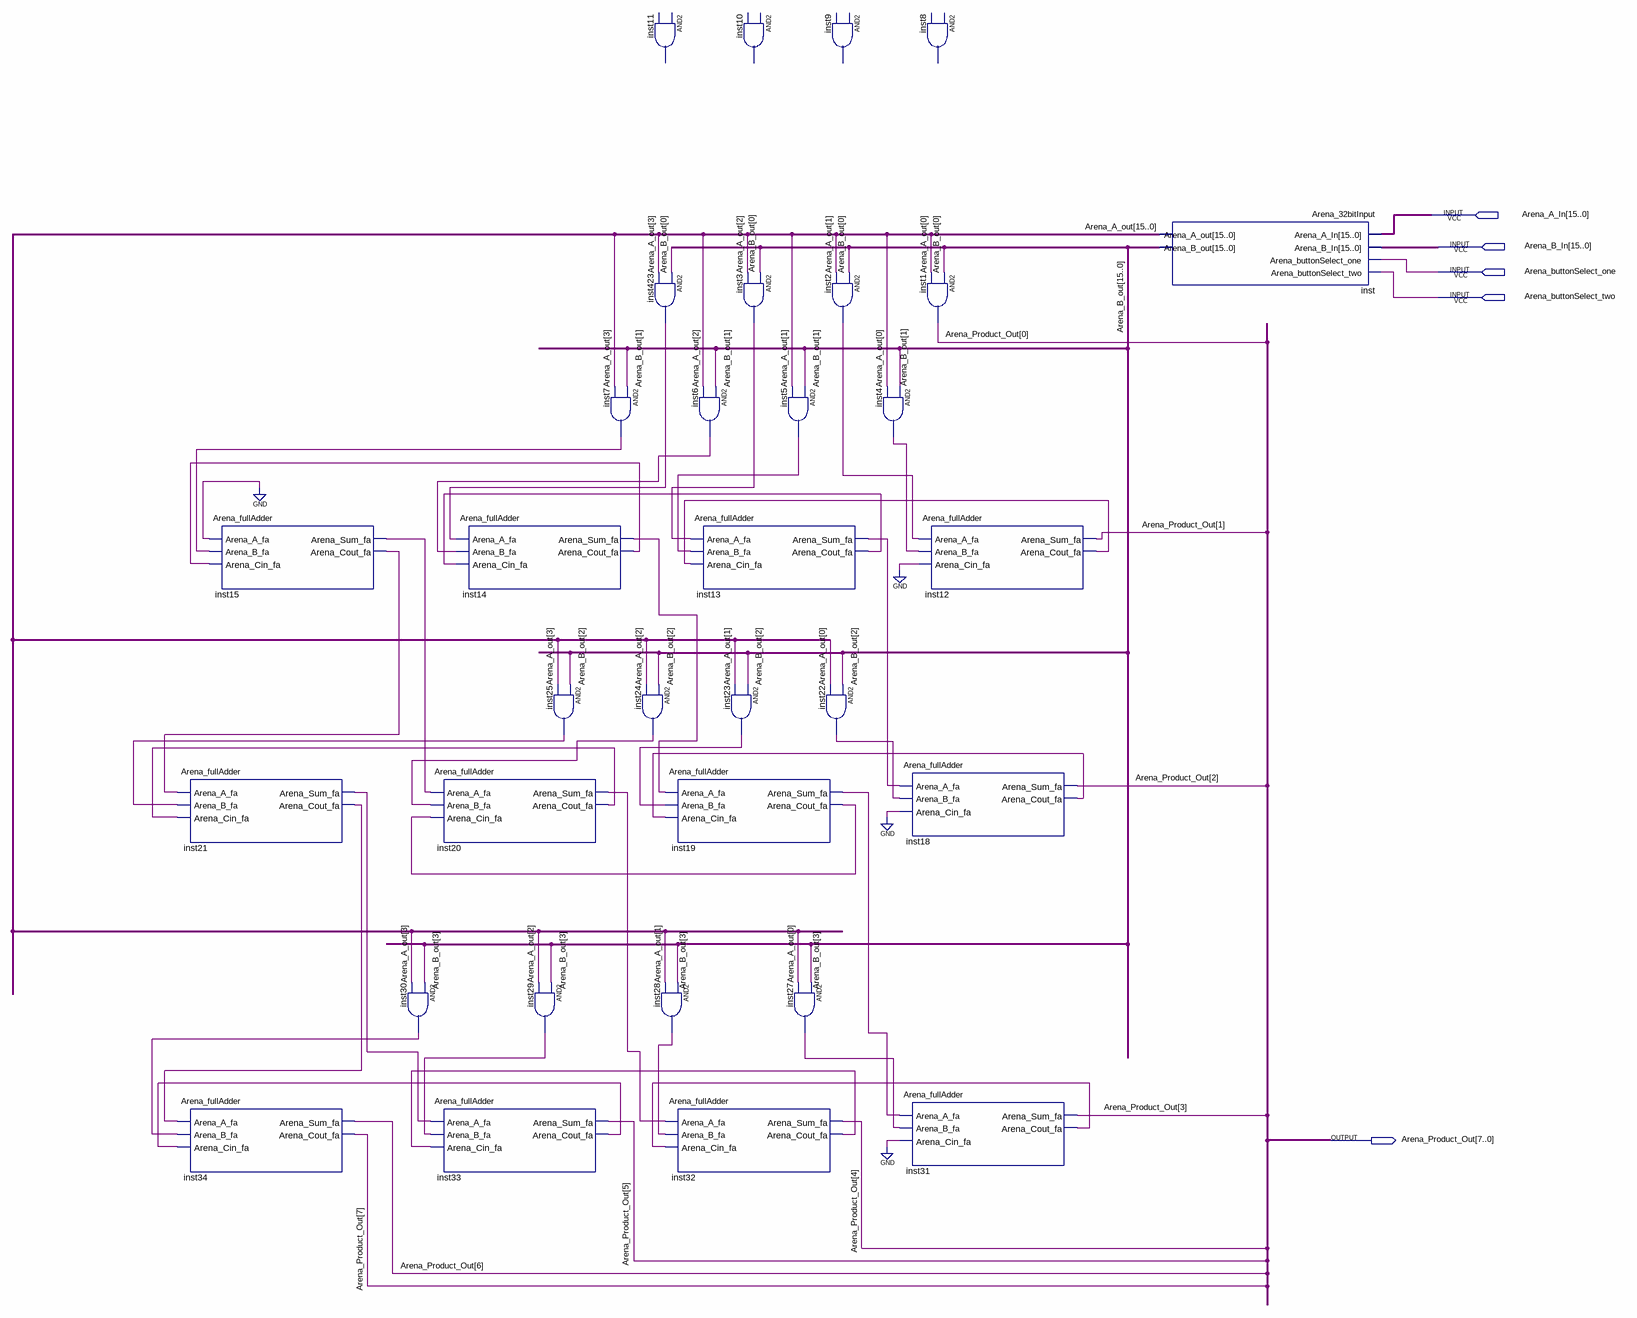
[diagram p0: schematic sheet]
// Quartus schematic Arena_32bit_arrayMultiplier_with_8bitAdders.bdf as structural Verilog: 33 symbols, 5 pins
module Arena_32bit_arrayMultiplier_with_8bitAdders (
  input  [15:0] Arena_A_In,
  input  [15:0] Arena_B_In,
  input  Arena_buttonSelect_one,
  input  Arena_buttonSelect_two,
  output [7:0] Arena_Product_Out
);

  wire inst2_out, inst3_out, inst4_out, inst5_out, inst6_out, inst7_out, inst12_arena_cout_fa,
       inst13_arena_cout_fa, inst13_arena_sum_fa, inst14_arena_cout_fa, inst14_arena_sum_fa,
       inst15_arena_cout_fa, inst15_arena_sum_fa, inst18_arena_cout_fa, inst19_arena_cout_fa,
       inst19_arena_sum_fa, inst20_arena_cout_fa, inst20_arena_sum_fa, inst21_arena_cout_fa,
       inst21_arena_sum_fa, inst22_out, inst23_out, inst24_out, inst25_out, inst27_out, inst28_out,
       inst29_out, inst30_out, inst31_arena_cout_fa, inst32_arena_cout_fa, inst33_arena_cout_fa, inst423_out;
  wire [15:0] Arena_A_out, Arena_B_out;

  Arena_fullAdder inst15 (
    .Arena_A_fa(1'b0), .Arena_B_fa(inst7_out), .Arena_Cin_fa(inst14_arena_cout_fa),
    .Arena_Sum_fa(inst15_arena_sum_fa), .Arena_Cout_fa(inst15_arena_cout_fa));
  Arena_fullAdder inst21 (
    .Arena_A_fa(inst15_arena_cout_fa), .Arena_B_fa(inst25_out), .Arena_Cin_fa(inst20_arena_cout_fa),
    .Arena_Sum_fa(inst21_arena_sum_fa), .Arena_Cout_fa(inst21_arena_cout_fa));
  Arena_fullAdder inst34 (
    .Arena_A_fa(inst21_arena_cout_fa), .Arena_B_fa(inst30_out), .Arena_Cin_fa(inst33_arena_cout_fa),
    .Arena_Sum_fa(Arena_Product_Out[6]), .Arena_Cout_fa(Arena_Product_Out[7]));
  and inst30 (inst30_out, Arena_B_out[3], Arena_A_out[3]);
  Arena_fullAdder inst14 (
    .Arena_A_fa(inst423_out), .Arena_B_fa(inst6_out), .Arena_Cin_fa(inst13_arena_cout_fa),
    .Arena_Sum_fa(inst14_arena_sum_fa), .Arena_Cout_fa(inst14_arena_cout_fa));
  Arena_fullAdder inst20 (
    .Arena_A_fa(inst15_arena_sum_fa), .Arena_B_fa(inst24_out), .Arena_Cin_fa(inst19_arena_cout_fa),
    .Arena_Sum_fa(inst20_arena_sum_fa), .Arena_Cout_fa(inst20_arena_cout_fa));
  Arena_fullAdder inst33 (
    .Arena_A_fa(inst21_arena_sum_fa), .Arena_B_fa(inst29_out), .Arena_Cin_fa(inst32_arena_cout_fa),
    .Arena_Sum_fa(Arena_Product_Out[5]), .Arena_Cout_fa(inst33_arena_cout_fa));
  and inst29 (inst29_out, Arena_B_out[3], Arena_A_out[2]);
  and inst25 (inst25_out, Arena_B_out[2], Arena_A_out[3]);
  and inst7 (inst7_out, Arena_B_out[1], Arena_A_out[3]);
  // AND2 inst11 is placed but not wired
  and inst423 (inst423_out, Arena_B_out[0], Arena_A_out[3]);
  and inst24 (inst24_out, Arena_B_out[2], Arena_A_out[2]);
  Arena_fullAdder inst19 (
    .Arena_A_fa(inst14_arena_sum_fa), .Arena_B_fa(inst23_out), .Arena_Cin_fa(inst18_arena_cout_fa),
    .Arena_Sum_fa(inst19_arena_sum_fa), .Arena_Cout_fa(inst19_arena_cout_fa));
  and inst28 (inst28_out, Arena_B_out[3], Arena_A_out[1]);
  Arena_fullAdder inst32 (
    .Arena_A_fa(inst20_arena_sum_fa), .Arena_B_fa(inst28_out), .Arena_Cin_fa(inst31_arena_cout_fa),
    .Arena_Sum_fa(Arena_Product_Out[4]), .Arena_Cout_fa(inst32_arena_cout_fa));
  and inst6 (inst6_out, Arena_B_out[1], Arena_A_out[2]);
  Arena_fullAdder inst13 (
    .Arena_A_fa(inst3_out), .Arena_B_fa(inst5_out), .Arena_Cin_fa(inst12_arena_cout_fa),
    .Arena_Sum_fa(inst13_arena_sum_fa), .Arena_Cout_fa(inst13_arena_cout_fa));
  and inst23 (inst23_out, Arena_B_out[2], Arena_A_out[1]);
  // AND2 inst10 is placed but not wired
  and inst3 (inst3_out, Arena_B_out[0], Arena_A_out[2]);
  and inst5 (inst5_out, Arena_B_out[1], Arena_A_out[1]);
  // AND2 inst9 is placed but not wired
  and inst2 (inst2_out, Arena_B_out[0], Arena_A_out[1]);
  and inst22 (inst22_out, Arena_B_out[2], Arena_A_out[0]);
  and inst27 (inst27_out, Arena_B_out[3], Arena_A_out[0]);
  and inst4 (inst4_out, Arena_B_out[1], Arena_A_out[0]);
  // AND2 inst8 is placed but not wired
  and inst1 (Arena_Product_Out[0], Arena_B_out[0], Arena_A_out[0]);
  Arena_fullAdder inst12 (
    .Arena_A_fa(inst2_out), .Arena_B_fa(inst4_out), .Arena_Cin_fa(1'b0), .Arena_Sum_fa(Arena_Product_Out[1]),
    .Arena_Cout_fa(inst12_arena_cout_fa));
  Arena_fullAdder inst18 (
    .Arena_A_fa(inst13_arena_sum_fa), .Arena_B_fa(inst22_out), .Arena_Cin_fa(1'b0),
    .Arena_Sum_fa(Arena_Product_Out[2]), .Arena_Cout_fa(inst18_arena_cout_fa));
  Arena_fullAdder inst31 (
    .Arena_A_fa(inst19_arena_sum_fa), .Arena_B_fa(inst27_out), .Arena_Cin_fa(1'b0),
    .Arena_Sum_fa(Arena_Product_Out[3]), .Arena_Cout_fa(inst31_arena_cout_fa));
  Arena_32bitInput inst (
    .Arena_A_In(Arena_A_In), .Arena_B_In(Arena_B_In), .Arena_buttonSelect_one(Arena_buttonSelect_one),
    .Arena_buttonSelect_two(Arena_buttonSelect_two), .Arena_A_out(Arena_A_out), .Arena_B_out(Arena_B_out));
endmodule
